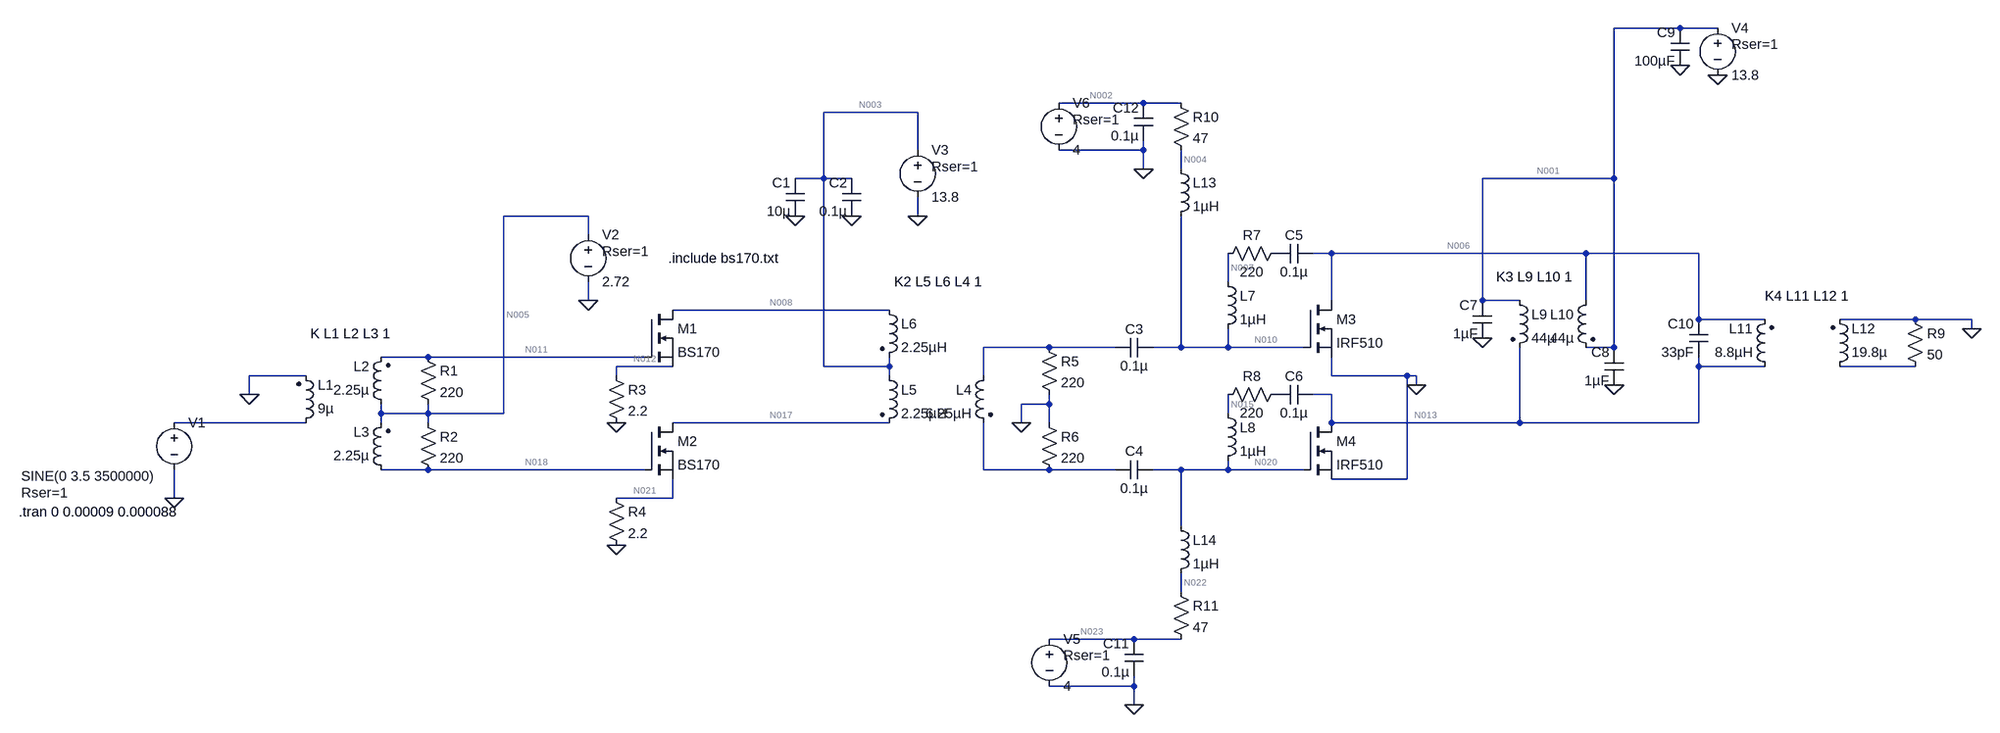
[diagram p0: schematic qlab 10w complete.asc]
qlab 10w complete.asc, the LTspice schematic file:
Version 4
SHEET 1 2916 680
WIRE 2400 -544 2288 -544
WIRE 2464 -544 2400 -544
WIRE 1488 -416 1344 -416
WIRE 1552 -416 1488 -416
WIRE 1104 -400 944 -400
WIRE 1104 -336 1104 -400
WIRE 1488 -336 1488 -352
WIRE 1488 -336 1344 -336
WIRE 1488 -304 1488 -336
WIRE 1552 -304 1552 -336
WIRE 944 -288 944 -400
WIRE 944 -288 896 -288
WIRE 992 -288 944 -288
WIRE 2288 -288 2288 -544
WIRE 2288 -288 2064 -288
WIRE 544 -224 400 -224
WIRE 1104 -224 1104 -256
WIRE 544 -192 544 -224
WIRE 1808 -160 1776 -160
WIRE 2240 -160 1808 -160
WIRE 2432 -160 2240 -160
WIRE 1632 -112 1632 -160
WIRE 544 -80 544 -112
WIRE 1808 -80 1808 -160
WIRE 2064 -80 2064 -288
WIRE 2128 -80 2064 -80
WIRE 2240 -80 2240 -160
WIRE 1056 -64 688 -64
WIRE 2432 -48 2432 -160
WIRE 2544 -48 2432 -48
WIRE 2800 -48 2672 -48
WIRE 2896 -48 2800 -48
WIRE 2896 -32 2896 -48
WIRE 1328 0 1216 0
WIRE 1440 0 1328 0
WIRE 1552 0 1552 -224
WIRE 1552 0 1504 0
WIRE 1632 0 1632 -32
WIRE 1632 0 1552 0
WIRE 1760 0 1632 0
WIRE 2288 0 2288 -288
WIRE 2288 0 2240 0
WIRE 272 16 192 16
WIRE 640 16 272 16
WIRE 688 32 592 32
WIRE 944 32 944 -288
WIRE 1056 32 1056 16
WIRE 1056 32 944 32
WIRE 2432 32 2432 16
WIRE 2544 32 2432 32
WIRE 2800 32 2672 32
WIRE 64 48 -32 48
WIRE 592 48 592 32
WIRE 1056 48 1056 32
WIRE 1216 48 1216 0
WIRE 1808 48 1808 16
WIRE 1936 48 1808 48
WIRE 1952 48 1936 48
WIRE 1952 64 1952 48
WIRE -32 80 -32 48
WIRE 1808 80 1776 80
WIRE 1328 96 1328 80
WIRE 1328 96 1280 96
WIRE 192 112 192 96
WIRE 272 112 272 96
WIRE 272 112 192 112
WIRE 400 112 400 -224
WIRE 400 112 272 112
WIRE 1632 112 1632 80
WIRE 64 128 -160 128
WIRE 192 128 192 112
WIRE 272 128 272 112
WIRE 1056 128 688 128
WIRE 1280 128 1280 96
WIRE 1328 128 1328 96
WIRE 1808 128 1808 80
WIRE 2128 128 2128 0
WIRE 2128 128 1808 128
WIRE 2432 128 2432 32
WIRE 2432 128 2128 128
WIRE 272 208 192 208
WIRE 640 208 272 208
WIRE 1216 208 1216 128
WIRE 1328 208 1216 208
WIRE 1440 208 1328 208
WIRE 1552 208 1504 208
WIRE 1632 208 1632 192
WIRE 1632 208 1552 208
WIRE 1760 208 1632 208
WIRE 1936 224 1936 48
WIRE 1936 224 1808 224
WIRE -160 256 -160 208
WIRE 688 256 688 224
WIRE 688 256 592 256
WIRE 1552 304 1552 208
WIRE 1552 416 1552 384
WIRE 1472 496 1328 496
WIRE 1552 496 1472 496
WIRE 1472 576 1472 560
WIRE 1472 576 1328 576
WIRE 1472 608 1472 576
FLAG -160 256 0
FLAG -32 80 0
FLAG 544 -80 0
FLAG 592 128 0
FLAG 592 336 0
FLAG 1104 -224 0
FLAG 1280 128 0
FLAG 896 -224 0
FLAG 992 -224 0
FLAG 1952 64 0
FLAG 2064 -16 0
FLAG 2288 64 0
FLAG 2464 -464 0
FLAG 2400 -480 0
FLAG 1472 608 0
FLAG 1488 -304 0
FLAG 2896 -32 0
DATAFLAG 544 16 ""
DATAFLAG 448 208 ""
DATAFLAG 864 -64 ""
DATAFLAG 1536 0 ""
DATAFLAG 1600 0 ""
DATAFLAG 1584 208 ""
DATAFLAG 1984 -160 ""
DATAFLAG 2000 128 ""
DATAFLAG 1424 -416 ""
SYMBOL ind2 48 144 M180
WINDOW 0 36 80 Left 2
WINDOW 3 36 40 Left 2
SYMATTR InstName L1
SYMATTR Value 9µ
SYMATTR Type ind
SYMBOL ind2 208 224 R180
WINDOW 0 36 80 Left 2
WINDOW 3 36 40 Left 2
SYMATTR InstName L3
SYMATTR Value 2.25µ
SYMATTR Type ind
SYMBOL ind2 208 112 R180
WINDOW 0 36 80 Left 2
WINDOW 3 36 40 Left 2
SYMATTR InstName L2
SYMATTR Value 2.25µ
SYMATTR Type ind
SYMBOL voltage -160 112 R0
WINDOW 3 -260 107 Left 2
WINDOW 123 0 0 Left 0
WINDOW 39 -260 135 Left 2
SYMATTR Value SINE(0 3.5 3500000)
SYMATTR SpiceLine Rser=1
SYMATTR InstName V1
SYMBOL res 256 0 R0
SYMATTR InstName R1
SYMATTR Value 220
SYMBOL res 256 112 R0
SYMATTR InstName R2
SYMATTR Value 220
SYMBOL voltage 544 -208 R0
WINDOW 123 0 0 Left 0
WINDOW 39 24 44 Left 2
SYMATTR SpiceLine Rser=1
SYMATTR InstName V2
SYMATTR Value 2.72
SYMBOL nmos 640 -64 R0
SYMATTR InstName M1
SYMATTR Value BS170
SYMATTR Prefix X
SYMBOL nmos 640 128 R0
SYMATTR InstName M2
SYMATTR Value BS170
SYMATTR Prefix X
SYMBOL res 576 32 R0
SYMATTR InstName R3
SYMATTR Value 2.2
SYMBOL res 576 240 R0
SYMATTR InstName R4
SYMATTR Value 2.2
SYMBOL ind2 1232 32 M0
SYMATTR InstName L4
SYMATTR Value 6.25µH
SYMATTR Type ind
SYMBOL ind2 1040 32 R0
SYMATTR InstName L5
SYMATTR Value 2.25µH
SYMATTR Type ind
SYMBOL ind2 1040 -80 R0
SYMATTR InstName L6
SYMATTR Value 2.25µH
SYMATTR Type ind
SYMBOL voltage 1104 -352 R0
WINDOW 123 0 0 Left 0
WINDOW 39 24 44 Left 2
SYMATTR SpiceLine Rser=1
SYMATTR InstName V3
SYMATTR Value 13.8
SYMBOL res 1312 -16 R0
SYMATTR InstName R5
SYMATTR Value 220
SYMBOL res 1312 112 R0
SYMATTR InstName R6
SYMATTR Value 220
SYMBOL cap 912 -224 R180
WINDOW 0 24 56 Left 2
WINDOW 3 24 8 Left 2
SYMATTR InstName C1
SYMATTR Value 10µ
SYMBOL cap 1008 -224 R180
WINDOW 0 24 56 Left 2
WINDOW 3 24 8 Left 2
SYMATTR InstName C2
SYMATTR Value 0.1µ
SYMBOL cap 1504 -16 R90
WINDOW 0 0 32 VBottom 2
WINDOW 3 32 32 VTop 2
SYMATTR InstName C3
SYMATTR Value 0.1µ
SYMBOL cap 1504 192 R90
WINDOW 0 0 32 VBottom 2
WINDOW 3 32 32 VTop 2
SYMATTR InstName C4
SYMATTR Value 0.1µ
SYMBOL nmos 1760 -80 R0
SYMATTR InstName M3
SYMATTR Value IRF510
SYMBOL nmos 1760 128 R0
SYMATTR InstName M4
SYMATTR Value IRF510
SYMBOL cap 1776 -176 R90
WINDOW 0 0 32 VBottom 2
WINDOW 3 32 32 VTop 2
SYMATTR InstName C5
SYMATTR Value 0.1µ
SYMBOL cap 1776 64 R90
WINDOW 0 0 32 VBottom 2
WINDOW 3 32 32 VTop 2
SYMATTR InstName C6
SYMATTR Value 0.1µ
SYMBOL res 1728 -176 R90
WINDOW 0 0 56 VBottom 2
WINDOW 3 32 56 VTop 2
SYMATTR InstName R7
SYMATTR Value 220
SYMBOL res 1728 64 R90
WINDOW 0 0 56 VBottom 2
WINDOW 3 32 56 VTop 2
SYMATTR InstName R8
SYMATTR Value 220
SYMBOL ind 1616 -128 R0
SYMATTR InstName L7
SYMATTR Value 1µH
SYMBOL ind 1616 96 R0
SYMATTR InstName L8
SYMATTR Value 1µH
SYMBOL ind2 2112 -96 R0
SYMATTR InstName L9
SYMATTR Value 44µ
SYMATTR Type ind
SYMATTR SpiceLine Rser=0.1
SYMBOL ind2 2256 -96 M0
SYMATTR InstName L10
SYMATTR Value 44µ
SYMATTR Type ind
SYMATTR SpiceLine Rser=0.1
SYMBOL cap 2080 -16 R180
WINDOW 0 24 56 Left 2
WINDOW 3 24 8 Left 2
SYMATTR InstName C7
SYMATTR Value 1µF
SYMBOL cap 2304 64 R180
WINDOW 0 24 56 Left 2
WINDOW 3 24 8 Left 2
SYMATTR InstName C8
SYMATTR Value 1µF
SYMBOL voltage 2464 -560 R0
WINDOW 123 0 0 Left 0
WINDOW 39 24 44 Left 2
SYMATTR InstName V4
SYMATTR Value 13.8
SYMATTR SpiceLine Rser=1
SYMBOL cap 2416 -480 R180
WINDOW 0 24 56 Left 2
WINDOW 3 24 8 Left 2
SYMATTR InstName C9
SYMATTR Value 100µF
SYMBOL cap 2448 16 R180
WINDOW 0 24 56 Left 2
WINDOW 3 24 8 Left 2
SYMATTR InstName C10
SYMATTR Value 33pF
SYMBOL ind2 2560 48 R180
WINDOW 0 36 80 Left 2
WINDOW 3 36 40 Left 2
SYMATTR InstName L11
SYMATTR Value 8.8µH
SYMATTR Type ind
SYMATTR SpiceLine Rser=0.1
SYMBOL ind2 2656 48 M180
WINDOW 0 36 80 Left 2
WINDOW 3 36 40 Left 2
SYMATTR InstName L12
SYMATTR Value 19.8µ
SYMATTR Type ind
SYMATTR SpiceLine Rser=0.1
SYMBOL res 2784 -64 R0
SYMATTR InstName R9
SYMATTR Value 50
SYMBOL ind 1536 -320 R0
SYMATTR InstName L13
SYMATTR Value 1µH
SYMBOL ind 1536 288 R0
SYMATTR InstName L14
SYMATTR Value 1µH
SYMBOL res 1536 -432 R0
SYMATTR InstName R10
SYMATTR Value 47
SYMBOL res 1536 400 R0
SYMATTR InstName R11
SYMATTR Value 47
SYMBOL cap 1488 560 R180
WINDOW 0 24 56 Left 2
WINDOW 3 24 8 Left 2
SYMATTR InstName C11
SYMATTR Value 0.1µ
SYMBOL voltage 1328 480 R0
WINDOW 123 0 0 Left 0
WINDOW 39 24 44 Left 2
SYMATTR InstName V5
SYMATTR Value 4
SYMATTR SpiceLine Rser=1
SYMBOL cap 1504 -352 R180
WINDOW 0 24 56 Left 2
WINDOW 3 24 8 Left 2
SYMATTR InstName C12
SYMATTR Value 0.1µ
SYMBOL voltage 1344 -432 R0
WINDOW 123 0 0 Left 0
WINDOW 39 24 44 Left 2
SYMATTR InstName V6
SYMATTR Value 4
SYMATTR SpiceLine Rser=1
TEXT -424 280 Left 2 !.tran 0 0.00009 0.000088
TEXT 72 -24 Left 2 !K L1 L2 L3 1
TEXT 1064 -112 Left 2 !K2 L5 L6 L4 1
TEXT 680 -152 Left 2 !.include bs170.txt
TEXT 2088 -120 Left 2 !K3 L9 L10 1
TEXT 2544 -88 Left 2 !K4 L11 L12 1

The netlist it stands for:
* qlab 10w complete.asc
L1 N016 0 9µ
L3 N018 N005 2.25µ
L2 N005 N011 2.25µ
V1 N016 0 SINE(0 3.5 3500000) Rser=1
R1 N011 N005 220
R2 N005 N018 220
V2 N005 0 2.72 Rser=1
XM1 N008 N011 N012 BS170  ; pins D G S
XM2 N017 N018 N021 BS170  ; pins D G S
R3 N012 0 2.2
R4 N021 0 2.2
L4 N009 N019 6.25µH
L5 N003 N017 2.25µH
L6 N008 N003 2.25µH
V3 N003 0 13.8 Rser=1
R5 N009 0 220
R6 0 N019 220
C1 0 N003 10µ
C2 0 N003 0.1µ
C3 N010 N009 0.1µ
C4 N020 N019 0.1µ
M3 N006 N010 0 0 IRF510
M4 N013 N020 0 0 IRF510
C5 N006 P001 0.1µ
C6 N013 P002 0.1µ
R7 P001 N007 220
R8 P002 N015 220
L7 N007 N010 1µH
L8 N015 N020 1µH
L9 N001 N013 44µ Rser=0.1
L10 N006 N001 44µ Rser=0.1
C7 0 N001 1µF
C8 0 N001 1µF
V4 N001 0 13.8 Rser=1
C9 0 N001 100µF
C10 N013 N006 33pF
L11 N013 N006 8.8µH Rser=0.1
L12 N014 0 19.8µ Rser=0.1
R9 0 N014 50
L13 N004 N010 1µH
L14 N020 N022 1µH
R10 N002 N004 47
R11 N022 N023 47
C11 0 N023 0.1µ
V5 N023 0 4 Rser=1
C12 0 N002 0.1µ
V6 N002 0 4 Rser=1
.model NMOS NMOS
.model PMOS PMOS
.lib standard.mos
.tran 0 0.00009 0.000088
K L1 L2 L3 1
K2 L5 L6 L4 1
.include bs170.txt
K3 L9 L10 1
K4 L11 L12 1
.backanno
.end

* Results of the author's LTspice run, read from the files saved beside the schematic
* Operating Point, zero values left out:
*   V(n018) = 2.72 V
*   V(n005) = 2.72 V
*   V(n011) = 2.72 V
*   V(n012) = 49.74 mV
*   V(n008) = 13.75 V
*   V(n021) = 49.74 mV
*   V(n017) = 13.75 V
*   V(n003) = 13.75 V
*   V(n010) = 4 V
*   V(n020) = 4 V
*   V(n006) = 13.73 V
*   V(n013) = 13.73 V
*   V(p001) = 4 V
*   V(p002) = 4 V
*   V(n007) = 4 V
*   V(n015) = 4 V
*   V(n001) = 13.73 V
*   V(n004) = 4 V
*   V(n022) = 4 V
*   V(n002) = 4 V
*   V(n023) = 4 V
*   Id(M4) = 32.95 mA
*   Is(M4) = -32.95 mA
*   Id(M3) = 32.95 mA
*   Is(M3) = -32.95 mA
*   I(L10) = -32.95 mA
*   I(L9) = 32.95 mA
*   I(L6) = -22.61 mA
*   I(L5) = 22.61 mA
*   I(R4) = 22.61 mA
*   I(R3) = 22.61 mA
*   I(V4) = -65.9 mA
*   I(V3) = -45.22 mA
*   Ix(m1:1) = 22.61 mA
*   Ix(m1:3) = -22.61 mA
*   Ix(m2:1) = 22.61 mA
*   Ix(m2:3) = -22.61 mA
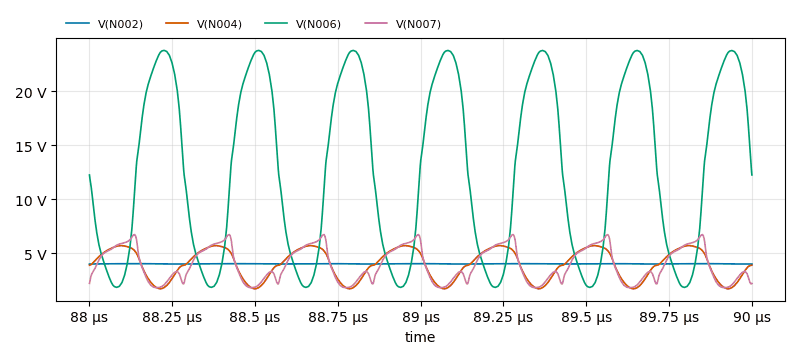
[diagram p1: Transient Analysis of qlab 10w complete.asc, plotted from the saved traces]
* Transient Analysis, 1 run:
*   V(N002): min 3.983 V, max 4.017 V, average 3.999 V, rms 3.999 V, last 3.985 V
*   V(N004): min 1.685 V, max 5.685 V, average 3.966 V, rms 4.205 V, last 3.872 V
*   V(N006): min 1.813 V, max 23.78 V, average 12.82 V, rms 15.27 V, last 12.23 V
*   V(N007): min 1.788 V, max 6.709 V, average 3.964 V, rms 4.273 V, last 2.188 V